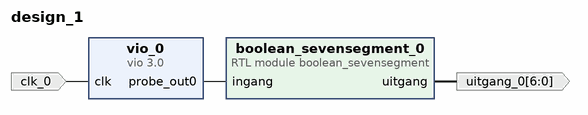
[diagram p0: block diagram of the top level]
# Vivado block design design_1, xc7z010iclg225-1L, Vivado 2022.1
create_bd_design design_1

create_bd_port -dir O -from 6 -to 0 uitgang_0
create_bd_port -dir I -type clk clk_0

create_bd_cell -type module -reference boolean_sevensegment boolean_sevensegment_0
create_bd_cell -type ip -vlnv xilinx.com:ip:vio:3.0 vio_0
set_property -dict {CONFIG.C_NUM_PROBE_IN 0 CONFIG.C_PROBE_OUT0_WIDTH 4} [get_bd_cells vio_0]

# ---- connections ----

connect_bd_net [get_bd_pins boolean_sevensegment_0/uitgang] [get_bd_ports uitgang_0]
connect_bd_net -net clk_0_1 [get_bd_ports clk_0] [get_bd_pins vio_0/clk]
connect_bd_net [get_bd_pins vio_0/probe_out0] [get_bd_pins boolean_sevensegment_0/ingang]

validate_bd_design
save_bd_design
